# EAGLE schematic Sensor_board_V_1_0 (EAGLE 9.6.2)
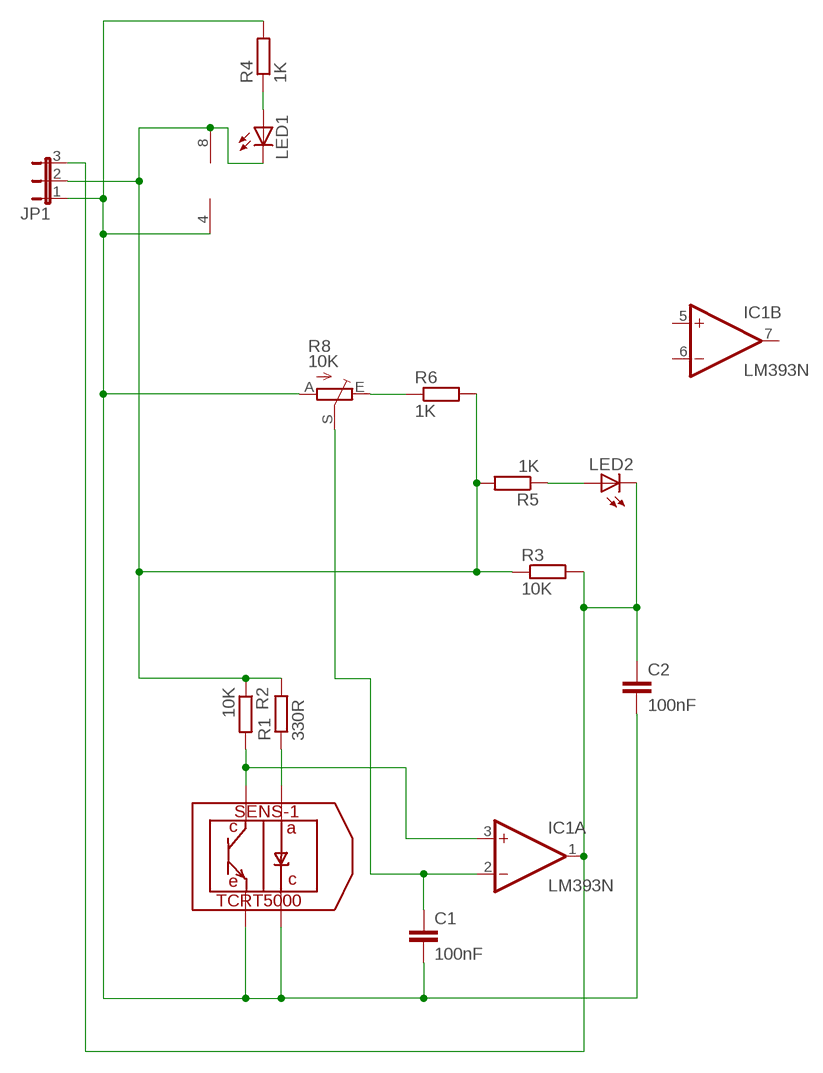
[diagram p0: schematic, sheet 1]

## Parts
C1  100nF  C-EU025_050-025X075  [C025_050-025X075]
C2  100nF  C-EU025_050-025X075  [C025_050-025X075]
IC1  LM393N  [DIL08]
JP1  JP2E  [JP2]
LED1  LED3MM  [LED3MM]
LED2  LED3MM  [LED3MM]
R1  330R  R-EU_0309/10  [0309/10]
R2  10K  R-EU_0309/10  [0309/10]
R3  10K  R-EU_0309/10  [0309/10]
R4  1K  R-EU_0309/10  [0309/10]
R5  1K  R-EU_0309/10  [0309/10]
R6  1K  R-EU_0309/10  [0309/10]
R8  10K  TRIM_EU-B64Y  [B64Y]
SENS-1  TCRT5000  [5000]

## Nets
N$1: IC1.8(P:V+) JP1.2 LED1.K(C) R1.2 R2.1 R3.1 R5.2 R6.2
N$2: LED1.A R4.1
N$3: C1.2 C2.2 IC1.4(P:V-) JP1.1 R4.2 R8.A SENS-1.P$2 SENS-1.P$4
N$4: R1.1 SENS-1.P$3
N$5: IC1.3(A:+IN) R2.2 SENS-1.P$1
N$6: C2.1 IC1.1(A:OUT) JP1.3 LED2.K(C) R3.2
N$7: LED2.A R5.1
N$8: R6.1 R8.E
N$9: C1.1 IC1.2(A:-IN) R8.S
Unconnected: IC1.5(B:+IN) IC1.6(B:-IN) IC1.7(B:OUT)

## Library data of the parts
C1 C2 = resistor:C-EU: CAPACITOR, European symbol
IC1 = linear4:LM393: COMPARATOR
JP1 = jumper:JP2E: JUMPER
LED1 LED2 = adafruit:LED: LED OSRAM: - CHIPLED LG R971, LG N971, LY N971, LG Q971, LY Q971, LO R971, LY R971 LH N974, LH R974 LS Q976, LO Q976, LY Q976 LO Q996 - Hyper CHIPLED LW Q18S LB Q993, LB Q99A, LB R99A - SideLED LS A670, LO A670, LY A670, LG A670, LP A670 LB A673, LV A673, LT A673, LW A673 LH A674 LY A675 LS A676, LA A676, LO A676, LY A676, LW A676 LS A679, LY A679, LG A679 - Hyper Micro SIDELED® LS Y876, LA Y876, LO Y876, LY Y876 LT Y87S - SmartLED LW L88C, LW L88S LB L89C, LB L89S, LG L890 LS L89K, LO L89K, LY L89K LS L896, LA L896, LO L896, LY L896 - TOPLED LS T670, LO T670, LY T670, LG T670, LP T670 LSG T670, LSP T670, LSY T670, LOP T670, LYG T670 LG T671, LOG T671, LSG T671 LB T673, LV T673, LT T673, LW T673 LH T674 LS T676, LA T676, LO T676, LY T676, LB T676, LH T676, LSB T676, LW T676 LB T67C, LV T67C, LT T67C, LS T67K, LO T67K, LY T67K, LW E67C LS E67B, LA E67B, LO E67B, LY E67B, LB E67C, LV E67C, LT E67C LW T67C LS T679, LY T679, LG T679 LS T770, LO T770, LY T770, LG T770, LP T770 LB T773, LV T773, LT T773, LW T773 LH T774 LS E675, LA E675, LY E675, LS T675 LS T776, LA T776, LO T776, LY T776, LB T776 LHGB T686 LT T68C, LB T68C - Hyper Mini TOPLED® LB M676 - Mini TOPLED Santana® LG M470 LS M47K, LO M47K, LY M47K Source: http://www.osram.convergy.de/
R1-R6 = resistor:R-EU_: RESISTOR, European symbol
R8 = pot:TRIM_EU-: POTENTIOMETER
SENS-1 = qfm-trx1-24g:TCRT5000: Reflective Optical Sensor with Transistor Output. Vishay Semiconductors